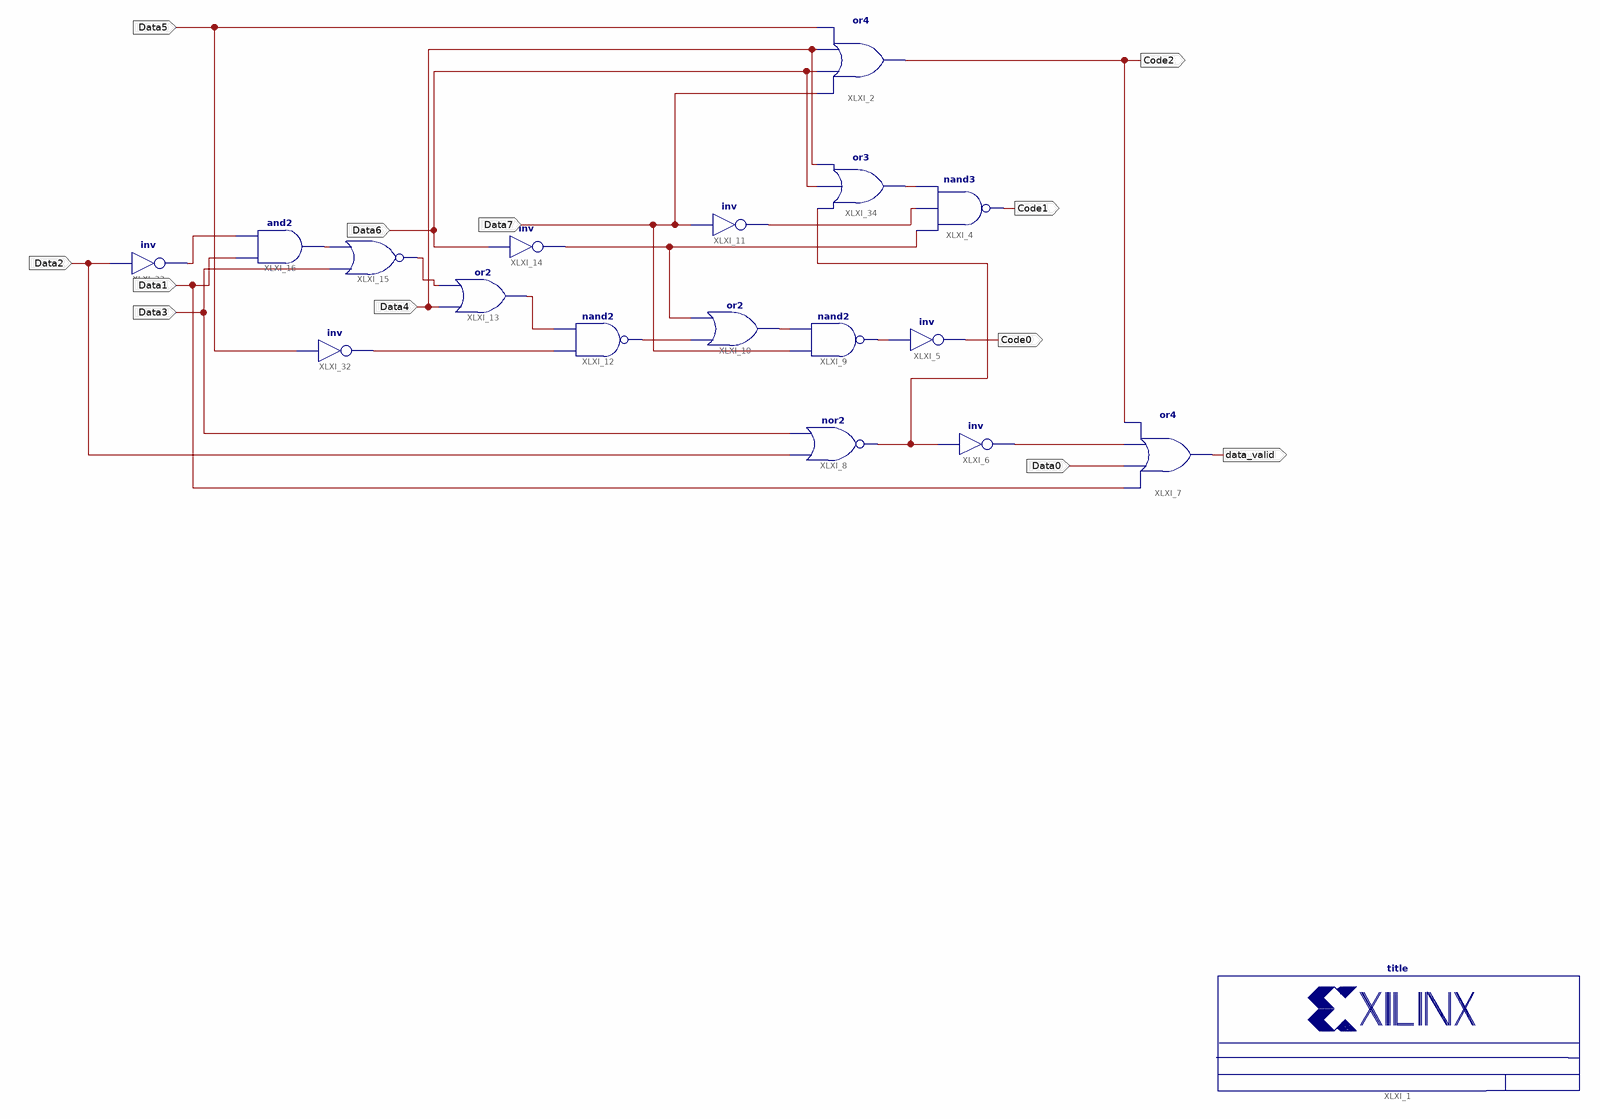
[diagram p0: schematic sheet 1]
// Xilinx ISE schematic fig_5_12.sch (spartan3e) as structural Verilog: 18 symbols, 12 ports
module fig_5_12 (
  input  Data0,
  input  Data7,
  input  Data5,
  input  Data6,
  input  Data2,
  input  Data1,
  input  Data3,
  input  Data4,
  output Code2,
  output Code0,
  output Code1,
  output data_valid
);

  wire XLXN_1, XLXN_2, XLXN_3, XLXN_4, XLXN_9, XLXN_11, XLXN_14, XLXN_15, XLXN_22, XLXN_26, XLXN_28, XLXN_29,
       XLXN_37;

  title #(.TitleFieldText("8:3 priority encoder"), .NameFieldText("Figure 5.12")) XLXI_1 ();
  nand XLXI_4 (Code1, XLXN_22, XLXN_15, XLXN_1);
  not XLXI_5 (Code0, XLXN_9);
  not XLXI_6 (XLXN_11, XLXN_14);
  or XLXI_7 (data_valid, Data1, Data0, XLXN_11, Code2);
  nor XLXI_8 (XLXN_14, Data2, Data3);
  nand XLXI_9 (XLXN_9, Data7, XLXN_2);
  or XLXI_10 (XLXN_2, XLXN_26, XLXN_22);
  not XLXI_11 (XLXN_15, Data7);
  or XLXI_2 (Code2, Data7, Data6, Data4, Data5);
  nand XLXI_12 (XLXN_26, XLXN_28, XLXN_3);
  or XLXI_13 (XLXN_3, Data4, XLXN_37);
  not XLXI_14 (XLXN_22, Data6);
  not XLXI_32 (XLXN_28, Data5);
  not XLXI_33 (XLXN_29, Data2);
  or XLXI_34 (XLXN_1, XLXN_14, Data6, Data4);
  nor XLXI_15 (XLXN_37, Data3, XLXN_4);
  and XLXI_16 (XLXN_4, Data1, XLXN_29);
endmodule
